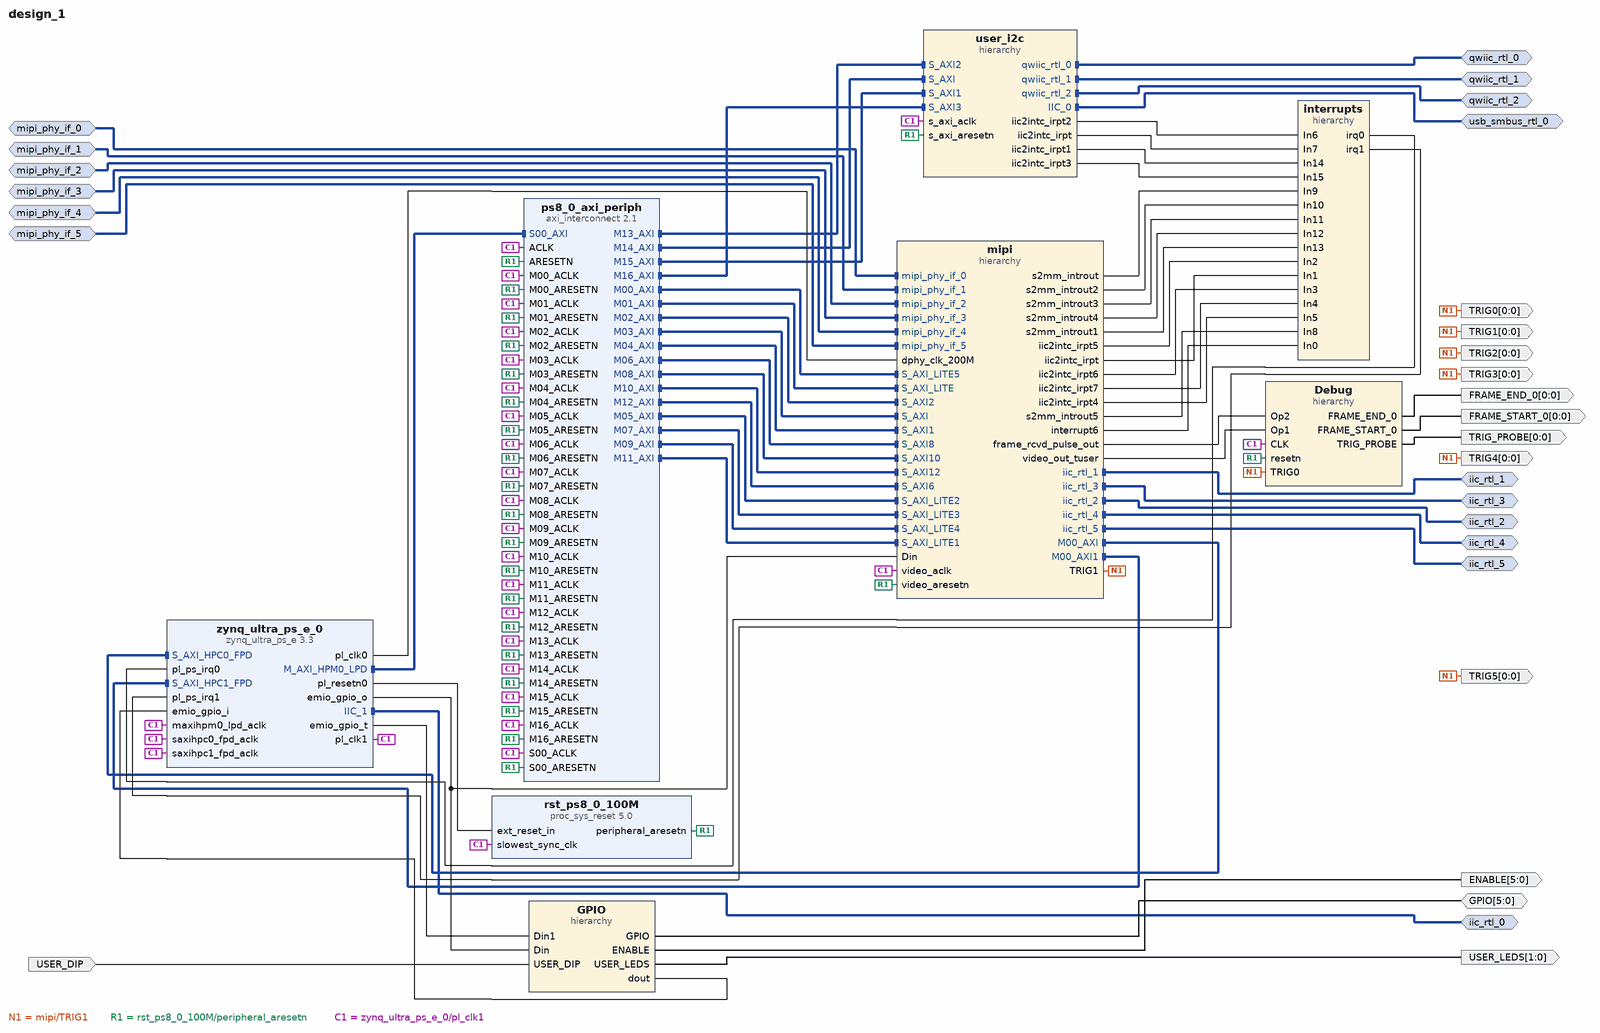
[diagram p0: block diagram of the top level]
# Vivado block design design_1, xczu4ev-sfvc784-1-i, Vivado 2021.2
create_bd_design design_1

create_bd_intf_port -mode Slave -vlnv xilinx.com:interface:mipi_phy_rtl:1.0 mipi_phy_if_0
create_bd_intf_port -mode Master -vlnv xilinx.com:interface:iic_rtl:1.0 iic_rtl_0
create_bd_intf_port -mode Slave -vlnv xilinx.com:interface:mipi_phy_rtl:1.0 mipi_phy_if_1
create_bd_intf_port -mode Master -vlnv xilinx.com:interface:iic_rtl:1.0 iic_rtl_1
create_bd_intf_port -mode Slave -vlnv xilinx.com:interface:mipi_phy_rtl:1.0 mipi_phy_if_3
create_bd_intf_port -mode Slave -vlnv xilinx.com:interface:mipi_phy_rtl:1.0 mipi_phy_if_2
create_bd_intf_port -mode Slave -vlnv xilinx.com:interface:mipi_phy_rtl:1.0 mipi_phy_if_4
create_bd_intf_port -mode Slave -vlnv xilinx.com:interface:mipi_phy_rtl:1.0 mipi_phy_if_5
create_bd_intf_port -mode Master -vlnv xilinx.com:interface:iic_rtl:1.0 iic_rtl_2
create_bd_intf_port -mode Master -vlnv xilinx.com:interface:iic_rtl:1.0 iic_rtl_3
create_bd_intf_port -mode Master -vlnv xilinx.com:interface:iic_rtl:1.0 iic_rtl_4
create_bd_intf_port -mode Master -vlnv xilinx.com:interface:iic_rtl:1.0 iic_rtl_5
create_bd_intf_port -mode Master -vlnv xilinx.com:interface:iic_rtl:1.0 qwiic_rtl_0
create_bd_intf_port -mode Master -vlnv xilinx.com:interface:iic_rtl:1.0 qwiic_rtl_1
create_bd_intf_port -mode Master -vlnv xilinx.com:interface:iic_rtl:1.0 qwiic_rtl_2
create_bd_intf_port -mode Master -vlnv xilinx.com:interface:iic_rtl:1.0 usb_smbus_rtl_0
create_bd_port -dir O -from 0 -to 0 TRIG1
create_bd_port -dir O -from 0 -to 0 TRIG_PROBE
create_bd_port -dir O -from 0 -to 0 FRAME_START_0
create_bd_port -dir O -from 0 -to 0 FRAME_END_0
create_bd_port -dir O -from 0 -to 0 TRIG2
create_bd_port -dir O -from 0 -to 0 TRIG3
create_bd_port -dir O -from 0 -to 0 TRIG4
create_bd_port -dir O -from 0 -to 0 TRIG5
create_bd_port -dir O -from 5 -to 0 ENABLE
create_bd_port -dir O -from 1 -to 0 USER_LEDS
create_bd_port -dir I USER_DIP
create_bd_port -dir IO -from 5 -to 0 GPIO
create_bd_port -dir O -from 0 -to 0 TRIG0

create_bd_cell -type hier GPIO
create_bd_cell -type hier mipi
create_bd_cell -type hier interrupts
create_bd_cell -type hier user_i2c
create_bd_cell -type hier Debug
create_bd_cell -type ip -vlnv xilinx.com:ip:proc_sys_reset:5.0 rst_ps8_0_100M
create_bd_cell -type ip -vlnv xilinx.com:ip:axi_interconnect:2.1 ps8_0_axi_periph
set_property -dict {CONFIG.ENABLE_ADVANCED_OPTIONS 0 CONFIG.NUM_MI 17 CONFIG.NUM_SI 1} [get_bd_cells ps8_0_axi_periph]
create_bd_cell -type ip -vlnv xilinx.com:ip:zynq_ultra_ps_e:3.3 zynq_ultra_ps_e_0
set_property -dict [list \
  CONFIG.CAN0_BOARD_INTERFACE custom \
  CONFIG.CAN1_BOARD_INTERFACE custom \
  CONFIG.CSU_BOARD_INTERFACE custom \
  CONFIG.DP_BOARD_INTERFACE custom \
  CONFIG.GEM0_BOARD_INTERFACE custom \
  CONFIG.GEM1_BOARD_INTERFACE custom \
  CONFIG.GEM2_BOARD_INTERFACE custom \
  CONFIG.GEM3_BOARD_INTERFACE custom \
  CONFIG.GPIO_BOARD_INTERFACE custom \
  CONFIG.IIC0_BOARD_INTERFACE custom \
  CONFIG.IIC1_BOARD_INTERFACE custom \
  CONFIG.NAND_BOARD_INTERFACE custom \
  CONFIG.PCIE_BOARD_INTERFACE custom \
  CONFIG.PJTAG_BOARD_INTERFACE custom \
  CONFIG.PMU_BOARD_INTERFACE custom \
  CONFIG.PSU_BANK_0_IO_STANDARD LVCMOS18 \
  CONFIG.PSU_BANK_1_IO_STANDARD LVCMOS18 \
  CONFIG.PSU_BANK_2_IO_STANDARD LVCMOS18 \
  CONFIG.PSU_BANK_3_IO_STANDARD LVCMOS18 \
  CONFIG.PSU_USB3__DUAL_CLOCK_ENABLE 1 \
  CONFIG.PSU__ACPU2__POWER__ON 0 \
  CONFIG.PSU__ACPU3__POWER__ON 0 \
  CONFIG.PSU__CAN1__PERIPHERAL__ENABLE 0 \
  CONFIG.PSU__CRF_APB__ACPU_CTRL__FREQMHZ 1200 \
  CONFIG.PSU__CRF_APB__ACPU_CTRL__SRCSEL APLL \
  CONFIG.PSU__CRF_APB__APLL_CTRL__SRCSEL PSS_REF_CLK \
  CONFIG.PSU__CRF_APB__DBG_FPD_CTRL__FREQMHZ 250 \
  CONFIG.PSU__CRF_APB__DBG_FPD_CTRL__SRCSEL IOPLL \
  CONFIG.PSU__CRF_APB__DBG_TRACE_CTRL__FREQMHZ 250 \
  CONFIG.PSU__CRF_APB__DBG_TRACE_CTRL__SRCSEL IOPLL \
  CONFIG.PSU__CRF_APB__DBG_TSTMP_CTRL__FREQMHZ 250 \
  CONFIG.PSU__CRF_APB__DBG_TSTMP_CTRL__SRCSEL IOPLL \
  CONFIG.PSU__CRF_APB__DDR_CTRL__FREQMHZ 1200 \
  CONFIG.PSU__CRF_APB__DDR_CTRL__SRCSEL DPLL \
  CONFIG.PSU__CRF_APB__DPDMA_REF_CTRL__FREQMHZ 600 \
  CONFIG.PSU__CRF_APB__DPDMA_REF_CTRL__SRCSEL DPLL \
  CONFIG.PSU__CRF_APB__DPLL_CTRL__SRCSEL PSS_REF_CLK \
  CONFIG.PSU__CRF_APB__DP_AUDIO_REF_CTRL__SRCSEL VPLL \
  CONFIG.PSU__CRF_APB__DP_STC_REF_CTRL__SRCSEL VPLL \
  CONFIG.PSU__CRF_APB__DP_VIDEO_REF_CTRL__SRCSEL DPLL \
  CONFIG.PSU__CRF_APB__GDMA_REF_CTRL__FREQMHZ 600 \
  CONFIG.PSU__CRF_APB__GDMA_REF_CTRL__SRCSEL DPLL \
  CONFIG.PSU__CRF_APB__GPU_REF_CTRL__FREQMHZ 600 \
  CONFIG.PSU__CRF_APB__GPU_REF_CTRL__SRCSEL DPLL \
  CONFIG.PSU__CRF_APB__TOPSW_LSBUS_CTRL__FREQMHZ 100 \
  CONFIG.PSU__CRF_APB__TOPSW_LSBUS_CTRL__SRCSEL IOPLL \
  CONFIG.PSU__CRF_APB__TOPSW_MAIN_CTRL__FREQMHZ 500 \
  CONFIG.PSU__CRF_APB__TOPSW_MAIN_CTRL__SRCSEL VPLL \
  CONFIG.PSU__CRF_APB__VPLL_CTRL__SRCSEL PSS_REF_CLK \
  CONFIG.PSU__CRL_APB__ADMA_REF_CTRL__FREQMHZ 500 \
  CONFIG.PSU__CRL_APB__ADMA_REF_CTRL__SRCSEL RPLL \
  CONFIG.PSU__CRL_APB__CAN1_REF_CTRL__FREQMHZ 100 \
  CONFIG.PSU__CRL_APB__CAN1_REF_CTRL__SRCSEL IOPLL \
  CONFIG.PSU__CRL_APB__CPU_R5_CTRL__FREQMHZ 500 \
  CONFIG.PSU__CRL_APB__CPU_R5_CTRL__SRCSEL RPLL \
  CONFIG.PSU__CRL_APB__DBG_LPD_CTRL__FREQMHZ 250 \
  CONFIG.PSU__CRL_APB__DBG_LPD_CTRL__SRCSEL IOPLL \
  CONFIG.PSU__CRL_APB__GEM3_REF_CTRL__FREQMHZ 125 \
  CONFIG.PSU__CRL_APB__GEM3_REF_CTRL__SRCSEL IOPLL \
  CONFIG.PSU__CRL_APB__I2C0_REF_CTRL__FREQMHZ 100 \
  CONFIG.PSU__CRL_APB__I2C0_REF_CTRL__SRCSEL IOPLL \
  CONFIG.PSU__CRL_APB__I2C1_REF_CTRL__FREQMHZ 100 \
  CONFIG.PSU__CRL_APB__I2C1_REF_CTRL__SRCSEL IOPLL \
  CONFIG.PSU__CRL_APB__IOPLL_CTRL__SRCSEL PSS_REF_CLK \
  CONFIG.PSU__CRL_APB__IOU_SWITCH_CTRL__FREQMHZ 250 \
  CONFIG.PSU__CRL_APB__IOU_SWITCH_CTRL__SRCSEL RPLL \
  CONFIG.PSU__CRL_APB__LPD_LSBUS_CTRL__FREQMHZ 100 \
  CONFIG.PSU__CRL_APB__LPD_LSBUS_CTRL__SRCSEL IOPLL \
  CONFIG.PSU__CRL_APB__LPD_SWITCH_CTRL__FREQMHZ 500 \
  CONFIG.PSU__CRL_APB__LPD_SWITCH_CTRL__SRCSEL RPLL \
  CONFIG.PSU__CRL_APB__PCAP_CTRL__FREQMHZ 200 \
  CONFIG.PSU__CRL_APB__PCAP_CTRL__SRCSEL IOPLL \
  CONFIG.PSU__CRL_APB__PL0_REF_CTRL__FREQMHZ 200 \
  CONFIG.PSU__CRL_APB__PL0_REF_CTRL__SRCSEL RPLL \
  CONFIG.PSU__CRL_APB__QSPI_REF_CTRL__FREQMHZ 50 \
  CONFIG.PSU__CRL_APB__QSPI_REF_CTRL__SRCSEL IOPLL \
  CONFIG.PSU__CRL_APB__RPLL_CTRL__SRCSEL PSS_REF_CLK \
  CONFIG.PSU__CRL_APB__SDIO1_REF_CTRL__FREQMHZ 50 \
  CONFIG.PSU__CRL_APB__SDIO1_REF_CTRL__SRCSEL RPLL \
  CONFIG.PSU__CRL_APB__TIMESTAMP_REF_CTRL__FREQMHZ 100 \
  CONFIG.PSU__CRL_APB__TIMESTAMP_REF_CTRL__SRCSEL PSS_REF_CLK \
  CONFIG.PSU__CRL_APB__UART0_REF_CTRL__FREQMHZ 100 \
  CONFIG.PSU__CRL_APB__UART0_REF_CTRL__SRCSEL IOPLL \
  CONFIG.PSU__CRL_APB__UART1_REF_CTRL__FREQMHZ 100 \
  CONFIG.PSU__CRL_APB__UART1_REF_CTRL__SRCSEL IOPLL \
  CONFIG.PSU__CRL_APB__USB0_BUS_REF_CTRL__FREQMHZ 250 \
  CONFIG.PSU__CRL_APB__USB0_BUS_REF_CTRL__SRCSEL IOPLL \
  CONFIG.PSU__CRL_APB__USB3_DUAL_REF_CTRL__FREQMHZ 20 \
  CONFIG.PSU__CRL_APB__USB3_DUAL_REF_CTRL__SRCSEL IOPLL \
  CONFIG.PSU__CRL_APB__USB3__ENABLE 1 \
  CONFIG.PSU__CSUPMU__PERIPHERAL__VALID 0 \
  CONFIG.PSU__DDRC__BUS_WIDTH {64 Bit} \
  CONFIG.PSU__DDRC__COMPONENTS Components \
  CONFIG.PSU__DDRC__DEVICE_CAPACITY {4096 MBits} \
  CONFIG.PSU__DDRC__DRAM_WIDTH {16 Bits} \
  CONFIG.PSU__DDRC__ECC Enabled \
  CONFIG.PSU__DDRC__MEMORY_TYPE {DDR 4} \
  CONFIG.PSU__DDRC__SPEED_BIN DDR4_2400T \
  CONFIG.PSU__DDR_HIGH_ADDRESS_GUI_ENABLE 0 \
  CONFIG.PSU__DDR__INTERFACE__FREQMHZ 600.000 \
  CONFIG.PSU__DEVICE_TYPE EV \
  CONFIG.PSU__DISPLAYPORT__PERIPHERAL__ENABLE 0 \
  CONFIG.PSU__DLL__ISUSED 1 \
  CONFIG.PSU__ENET0__GRP_MDIO__ENABLE 1 \
  CONFIG.PSU__ENET0__GRP_MDIO__IO {MIO 76 .. 77} \
  CONFIG.PSU__ENET0__PERIPHERAL__ENABLE 1 \
  CONFIG.PSU__ENET0__PERIPHERAL__IO {MIO 26 .. 37} \
  CONFIG.PSU__ENET3__PERIPHERAL__ENABLE 0 \
  CONFIG.PSU__FPD_SLCR__WDT1__FREQMHZ 100 \
  CONFIG.PSU__FPGA_PL0_ENABLE 1 \
  CONFIG.PSU__FPGA_PL1_ENABLE 1 \
  CONFIG.PSU__GEM__TSU__ENABLE 0 \
  CONFIG.PSU__GPIO0_MIO__IO {MIO 0 .. 25} \
  CONFIG.PSU__GPIO0_MIO__PERIPHERAL__ENABLE 1 \
  CONFIG.PSU__GPIO1_MIO__IO {MIO 26 .. 51} \
  CONFIG.PSU__GPIO1_MIO__PERIPHERAL__ENABLE 1 \
  CONFIG.PSU__GPIO_EMIO_WIDTH 22 \
  CONFIG.PSU__GPIO_EMIO__PERIPHERAL__ENABLE 1 \
  CONFIG.PSU__GPIO_EMIO__PERIPHERAL__IO 22 \
  CONFIG.PSU__GPU_PP0__POWER__ON 0 \
  CONFIG.PSU__GPU_PP1__POWER__ON 0 \
  CONFIG.PSU__I2C0__PERIPHERAL__ENABLE 1 \
  CONFIG.PSU__I2C0__PERIPHERAL__IO {MIO 10 .. 11} \
  CONFIG.PSU__I2C1__PERIPHERAL__ENABLE 1 \
  CONFIG.PSU__I2C1__PERIPHERAL__IO EMIO \
  CONFIG.PSU__IOU_SLCR__IOU_TTC_APB_CLK__TTC0_SEL APB \
  CONFIG.PSU__IOU_SLCR__IOU_TTC_APB_CLK__TTC1_SEL APB \
  CONFIG.PSU__IOU_SLCR__IOU_TTC_APB_CLK__TTC2_SEL APB \
  CONFIG.PSU__IOU_SLCR__IOU_TTC_APB_CLK__TTC3_SEL APB \
  CONFIG.PSU__IOU_SLCR__TTC1__FREQMHZ 100 \
  CONFIG.PSU__IOU_SLCR__TTC2__FREQMHZ 100 \
  CONFIG.PSU__IOU_SLCR__TTC3__FREQMHZ 100 \
  CONFIG.PSU__IOU_SLCR__WDT0__FREQMHZ 100 \
  CONFIG.PSU__LPD_SLCR__CSUPMU__FREQMHZ 100 \
  CONFIG.PSU__OVERRIDE_HPX_QOS 0 \
  CONFIG.PSU__OVERRIDE__BASIC_CLOCK 0 \
  CONFIG.PSU__PMU__PERIPHERAL__ENABLE 0 \
  CONFIG.PSU__PRESET_APPLIED 0 \
  CONFIG.PSU__PSS_REF_CLK__FREQMHZ 33.333 \
  CONFIG.PSU__QSPI_COHERENCY 0 \
  CONFIG.PSU__QSPI_ROUTE_THROUGH_FPD 0 \
  CONFIG.PSU__QSPI__GRP_FBCLK__ENABLE 1 \
  CONFIG.PSU__QSPI__GRP_FBCLK__IO {MIO 6} \
  CONFIG.PSU__QSPI__PERIPHERAL__DATA_MODE x4 \
  CONFIG.PSU__QSPI__PERIPHERAL__ENABLE 1 \
  CONFIG.PSU__QSPI__PERIPHERAL__IO {MIO 0 .. 5} \
  CONFIG.PSU__QSPI__PERIPHERAL__MODE Single \
  CONFIG.PSU__SATA__PERIPHERAL__ENABLE 0 \
  CONFIG.PSU__SD0__DATA_TRANSFER_MODE 8Bit \
  CONFIG.PSU__SD0__PERIPHERAL__ENABLE 1 \
  CONFIG.PSU__SD0__PERIPHERAL__IO {MIO 13 .. 22} \
  CONFIG.PSU__SD0__SLOT_TYPE eMMC \
  CONFIG.PSU__SD1_COHERENCY 0 \
  CONFIG.PSU__SD1_ROUTE_THROUGH_FPD 0 \
  CONFIG.PSU__SD1__DATA_TRANSFER_MODE 4Bit \
  CONFIG.PSU__SD1__GRP_CD__ENABLE 0 \
  CONFIG.PSU__SD1__GRP_POW__ENABLE 0 \
  CONFIG.PSU__SD1__GRP_WP__ENABLE 0 \
  CONFIG.PSU__SD1__PERIPHERAL__ENABLE 1 \
  CONFIG.PSU__SD1__PERIPHERAL__IO {MIO 46 .. 51} \
  CONFIG.PSU__SD1__SLOT_TYPE {SD 2.0} \
  CONFIG.PSU__SWDT0__PERIPHERAL__ENABLE 0 \
  CONFIG.PSU__SWDT1__PERIPHERAL__ENABLE 0 \
  CONFIG.PSU__TSU__BUFG_PORT_PAIR 0 \
  CONFIG.PSU__TTC0__CLOCK__ENABLE 0 \
  CONFIG.PSU__TTC0__PERIPHERAL__ENABLE 1 \
  CONFIG.PSU__TTC0__WAVEOUT__ENABLE 0 \
  CONFIG.PSU__TTC1__PERIPHERAL__ENABLE 0 \
  CONFIG.PSU__TTC2__PERIPHERAL__ENABLE 0 \
  CONFIG.PSU__TTC3__PERIPHERAL__ENABLE 0 \
  CONFIG.PSU__UART0__BAUD_RATE 115200 \
  CONFIG.PSU__UART0__MODEM__ENABLE 0 \
  CONFIG.PSU__UART0__PERIPHERAL__ENABLE 1 \
  CONFIG.PSU__UART0__PERIPHERAL__IO {MIO 38 .. 39} \
  CONFIG.PSU__UART1__PERIPHERAL__ENABLE 0 \
  CONFIG.PSU__USB0_COHERENCY 0 \
  CONFIG.PSU__USB0__PERIPHERAL__ENABLE 1 \
  CONFIG.PSU__USB0__PERIPHERAL__IO {MIO 52 .. 63} \
  CONFIG.PSU__USB0__REF_CLK_FREQ 100 \
  CONFIG.PSU__USB0__REF_CLK_SEL {Ref Clk2} \
  CONFIG.PSU__USB1__PERIPHERAL__ENABLE 1 \
  CONFIG.PSU__USB1__PERIPHERAL__IO {MIO 64 .. 75} \
  CONFIG.PSU__USB1__REF_CLK_FREQ 100 \
  CONFIG.PSU__USB1__REF_CLK_SEL {Ref Clk2} \
  CONFIG.PSU__USB2_0__EMIO__ENABLE 0 \
  CONFIG.PSU__USB3_0__EMIO__ENABLE 0 \
  CONFIG.PSU__USB3_0__PERIPHERAL__ENABLE 1 \
  CONFIG.PSU__USB3_0__PERIPHERAL__IO {GT Lane0} \
  CONFIG.PSU__USB3_1__PERIPHERAL__ENABLE 1 \
  CONFIG.PSU__USB3_1__PERIPHERAL__IO {GT Lane3} \
  CONFIG.PSU__USB__RESET__MODE {Boot Pin} \
  CONFIG.PSU__USB__RESET__POLARITY {Active Low} \
  CONFIG.PSU__USE__IRQ0 1 \
  CONFIG.PSU__USE__IRQ1 1 \
  CONFIG.PSU__USE__M_AXI_GP0 0 \
  CONFIG.PSU__USE__M_AXI_GP1 0 \
  CONFIG.PSU__USE__M_AXI_GP2 1 \
  CONFIG.PSU__USE__S_AXI_GP0 1 \
  CONFIG.PSU__USE__S_AXI_GP1 1 \
  CONFIG.QSPI_BOARD_INTERFACE custom \
  CONFIG.SATA_BOARD_INTERFACE custom \
  CONFIG.SD0_BOARD_INTERFACE custom \
  CONFIG.SD1_BOARD_INTERFACE custom \
  CONFIG.SPI0_BOARD_INTERFACE custom \
  CONFIG.SPI1_BOARD_INTERFACE custom \
  CONFIG.SUBPRESET1 Custom \
  CONFIG.SUBPRESET2 Custom \
  CONFIG.SWDT0_BOARD_INTERFACE custom \
  CONFIG.SWDT1_BOARD_INTERFACE custom \
  CONFIG.TRACE_BOARD_INTERFACE custom \
  CONFIG.TTC0_BOARD_INTERFACE custom \
  CONFIG.TTC1_BOARD_INTERFACE custom \
  CONFIG.TTC2_BOARD_INTERFACE custom \
  CONFIG.TTC3_BOARD_INTERFACE custom \
  CONFIG.UART0_BOARD_INTERFACE custom \
  CONFIG.UART1_BOARD_INTERFACE custom \
  CONFIG.USB0_BOARD_INTERFACE custom \
  CONFIG.USB1_BOARD_INTERFACE custom \
] [get_bd_cells zynq_ultra_ps_e_0]
# 738 more settings of zynq_ultra_ps_e_0 are not shown: defaults, MIO pin electricals, DDR timing, and values the tool derives

# ---- hierarchy /GPIO ----
current_bd_instance /GPIO
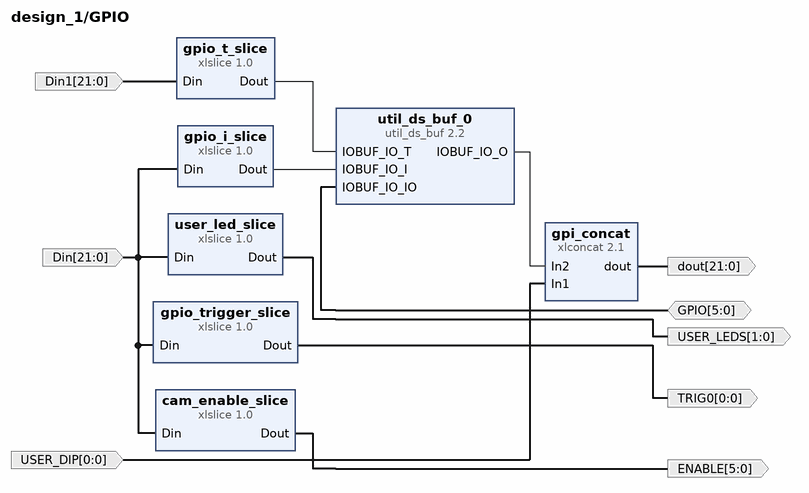
[diagram p1: block diagram inside /GPIO]
create_bd_pin -dir I -from 21 -to 0 Din
create_bd_pin -dir O -from 0 -to 0 TRIG0
create_bd_pin -dir O -from 1 -to 0 USER_LEDS
create_bd_pin -dir O -from 5 -to 0 ENABLE
create_bd_pin -dir I -from 21 -to 0 Din1
create_bd_pin -dir IO -from 5 -to 0 GPIO
create_bd_pin -dir I -from 0 -to 0 USER_DIP
create_bd_pin -dir O -from 21 -to 0 dout

create_bd_cell -type ip -vlnv xilinx.com:ip:xlslice:1.0 gpio_trigger_slice
set_property -dict {CONFIG.DIN_FROM 15 CONFIG.DIN_TO 15 CONFIG.DIN_WIDTH 22 CONFIG.DOUT_WIDTH 1} [get_bd_cells gpio_trigger_slice]
create_bd_cell -type ip -vlnv xilinx.com:ip:xlslice:1.0 user_led_slice
set_property -dict {CONFIG.DIN_FROM 8 CONFIG.DIN_TO 7 CONFIG.DIN_WIDTH 22 CONFIG.DOUT_WIDTH 2} [get_bd_cells user_led_slice]
create_bd_cell -type ip -vlnv xilinx.com:ip:xlslice:1.0 gpio_i_slice
set_property -dict {CONFIG.DIN_FROM 14 CONFIG.DIN_TO 9 CONFIG.DIN_WIDTH 22 CONFIG.DOUT_WIDTH 6} [get_bd_cells gpio_i_slice]
create_bd_cell -type ip -vlnv xilinx.com:ip:xlslice:1.0 cam_enable_slice
set_property -dict {CONFIG.DIN_FROM 5 CONFIG.DIN_WIDTH 22 CONFIG.DOUT_WIDTH 6} [get_bd_cells cam_enable_slice]
create_bd_cell -type ip -vlnv xilinx.com:ip:xlslice:1.0 gpio_t_slice
set_property -dict {CONFIG.DIN_FROM 14 CONFIG.DIN_TO 9 CONFIG.DIN_WIDTH 22 CONFIG.DOUT_WIDTH 6} [get_bd_cells gpio_t_slice]
create_bd_cell -type ip -vlnv xilinx.com:ip:xlconcat:2.1 gpi_concat
set_property -dict [list \
  CONFIG.IN0_WIDTH 8 \
  CONFIG.IN1_WIDTH 1 \
  CONFIG.IN2_WIDTH 6 \
  CONFIG.IN3_WIDTH 7 \
  CONFIG.NUM_PORTS 4 \
] [get_bd_cells gpi_concat]
create_bd_cell -type ip -vlnv xilinx.com:ip:util_ds_buf:2.2 util_ds_buf_0
set_property -dict {CONFIG.C_BUF_TYPE IOBUF CONFIG.C_SIZE 6} [get_bd_cells util_ds_buf_0]

# ---- hierarchy /mipi ----
current_bd_instance /mipi
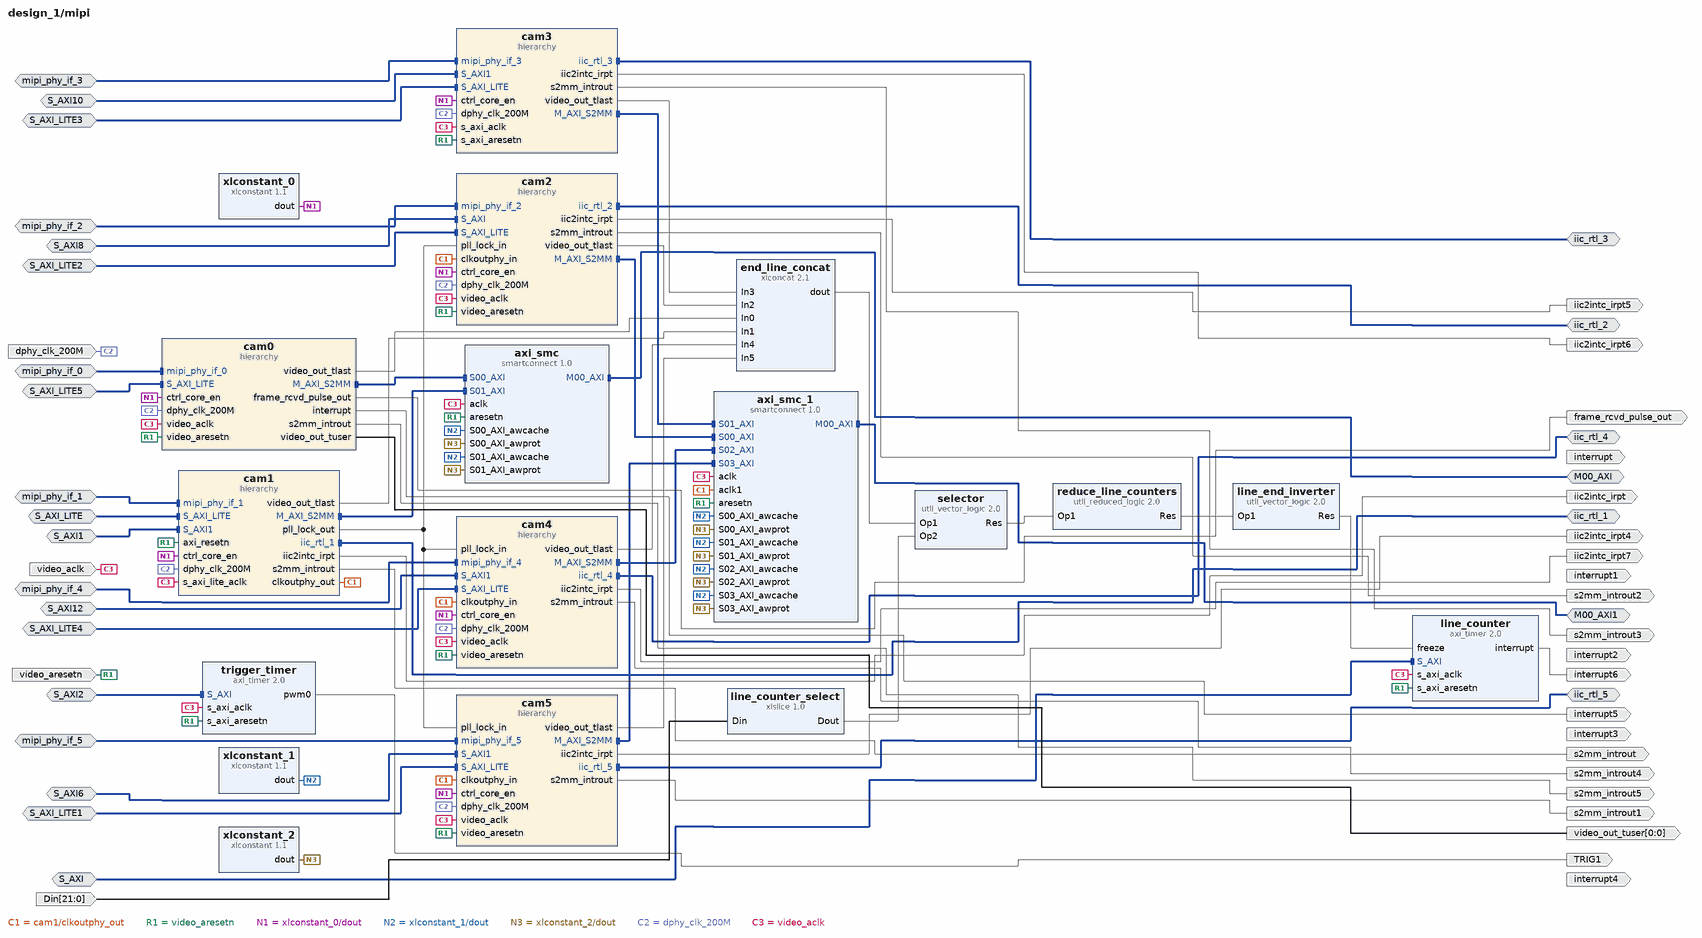
[diagram p2: block diagram inside /mipi]
create_bd_intf_pin -mode Slave -vlnv xilinx.com:interface:mipi_phy_rtl:1.0 mipi_phy_if_1
create_bd_intf_pin -mode Slave -vlnv xilinx.com:interface:aximm_rtl:1.0 S_AXI_LITE
create_bd_intf_pin -mode Slave -vlnv xilinx.com:interface:aximm_rtl:1.0 S_AXI1
create_bd_intf_pin -mode Master -vlnv xilinx.com:interface:iic_rtl:1.0 iic_rtl_1
create_bd_intf_pin -mode Slave -vlnv xilinx.com:interface:mipi_phy_rtl:1.0 mipi_phy_if_5
create_bd_intf_pin -mode Slave -vlnv xilinx.com:interface:aximm_rtl:1.0 S_AXI_LITE1
create_bd_intf_pin -mode Slave -vlnv xilinx.com:interface:aximm_rtl:1.0 S_AXI6
create_bd_intf_pin -mode Master -vlnv xilinx.com:interface:iic_rtl:1.0 iic_rtl_5
create_bd_intf_pin -mode Slave -vlnv xilinx.com:interface:mipi_phy_rtl:1.0 mipi_phy_if_2
create_bd_intf_pin -mode Slave -vlnv xilinx.com:interface:aximm_rtl:1.0 S_AXI_LITE2
create_bd_intf_pin -mode Slave -vlnv xilinx.com:interface:aximm_rtl:1.0 S_AXI8
create_bd_intf_pin -mode Master -vlnv xilinx.com:interface:iic_rtl:1.0 iic_rtl_2
create_bd_intf_pin -mode Slave -vlnv xilinx.com:interface:mipi_phy_rtl:1.0 mipi_phy_if_3
create_bd_intf_pin -mode Slave -vlnv xilinx.com:interface:aximm_rtl:1.0 S_AXI_LITE3
create_bd_intf_pin -mode Slave -vlnv xilinx.com:interface:aximm_rtl:1.0 S_AXI10
create_bd_intf_pin -mode Slave -vlnv xilinx.com:interface:aximm_rtl:1.0 S_AXI12
create_bd_intf_pin -mode Master -vlnv xilinx.com:interface:iic_rtl:1.0 iic_rtl_4
create_bd_intf_pin -mode Slave -vlnv xilinx.com:interface:mipi_phy_rtl:1.0 mipi_phy_if_4
create_bd_intf_pin -mode Slave -vlnv xilinx.com:interface:aximm_rtl:1.0 S_AXI_LITE4
create_bd_intf_pin -mode Slave -vlnv xilinx.com:interface:mipi_phy_rtl:1.0 mipi_phy_if_0
create_bd_intf_pin -mode Slave -vlnv xilinx.com:interface:aximm_rtl:1.0 S_AXI_LITE5
create_bd_intf_pin -mode Master -vlnv xilinx.com:interface:aximm_rtl:1.0 M00_AXI
create_bd_intf_pin -mode Master -vlnv xilinx.com:interface:aximm_rtl:1.0 M00_AXI1
create_bd_intf_pin -mode Master -vlnv xilinx.com:interface:iic_rtl:1.0 iic_rtl_3
create_bd_intf_pin -mode Slave -vlnv xilinx.com:interface:aximm_rtl:1.0 S_AXI
create_bd_intf_pin -mode Slave -vlnv xilinx.com:interface:aximm_rtl:1.0 S_AXI2
create_bd_pin -dir I -type clk dphy_clk_200M
create_bd_pin -dir I -type clk video_aclk
create_bd_pin -dir I -type rst video_aresetn
create_bd_pin -dir O -type intr s2mm_introut
create_bd_pin -dir O -type intr interrupt
create_bd_pin -dir O -type intr iic2intc_irpt
create_bd_pin -dir O -type intr interrupt1
create_bd_pin -dir O -type intr s2mm_introut1
create_bd_pin -dir O -type intr iic2intc_irpt4
create_bd_pin -dir O -type intr s2mm_introut2
create_bd_pin -dir O -type intr interrupt2
create_bd_pin -dir O -type intr iic2intc_irpt5
create_bd_pin -dir O -type intr s2mm_introut3
create_bd_pin -dir O -type intr interrupt3
create_bd_pin -dir O -type intr iic2intc_irpt6
create_bd_pin -dir O -type intr interrupt4
create_bd_pin -dir O -type intr iic2intc_irpt7
create_bd_pin -dir O -type intr s2mm_introut4
create_bd_pin -dir O -from 0 -to 0 video_out_tuser
create_bd_pin -dir O frame_rcvd_pulse_out
create_bd_pin -dir O -type intr s2mm_introut5
create_bd_pin -dir O -type intr interrupt5
create_bd_pin -dir O -type intr interrupt6
create_bd_pin -dir I -from 21 -to 0 Din
create_bd_pin -dir O TRIG1

create_bd_cell -type hier cam1
create_bd_cell -type hier cam5
create_bd_cell -type hier cam2
create_bd_cell -type hier cam3
create_bd_cell -type hier cam4
create_bd_cell -type hier cam0
create_bd_cell -type ip -vlnv xilinx.com:ip:util_vector_logic:2.0 selector
set_property -dict {CONFIG.C_SIZE 6} [get_bd_cells selector]
create_bd_cell -type ip -vlnv xilinx.com:ip:util_reduced_logic:2.0 reduce_line_counters
set_property -dict {CONFIG.C_OPERATION or CONFIG.C_SIZE 6} [get_bd_cells reduce_line_counters]
create_bd_cell -type ip -vlnv xilinx.com:ip:util_vector_logic:2.0 line_end_inverter
set_property -dict {CONFIG.C_OPERATION not CONFIG.C_SIZE 1} [get_bd_cells line_end_inverter]
create_bd_cell -type ip -vlnv xilinx.com:ip:xlconcat:2.1 end_line_concat
set_property -dict {CONFIG.NUM_PORTS 6 CONFIG.dout_width 6} [get_bd_cells end_line_concat]
create_bd_cell -type ip -vlnv xilinx.com:ip:xlslice:1.0 line_counter_select
set_property -dict [list \
  CONFIG.DIN_FROM 21 \
  CONFIG.DIN_TO 16 \
  CONFIG.DIN_WIDTH 22 \
  CONFIG.DOUT_WIDTH 6 \
] [get_bd_cells line_counter_select]
create_bd_cell -type ip -vlnv xilinx.com:ip:xlconstant:1.1 xlconstant_0
create_bd_cell -type ip -vlnv xilinx.com:ip:xlconstant:1.1 xlconstant_1
set_property -dict {CONFIG.CONST_VAL 15 CONFIG.CONST_WIDTH 4} [get_bd_cells xlconstant_1]
create_bd_cell -type ip -vlnv xilinx.com:ip:xlconstant:1.1 xlconstant_2
set_property -dict {CONFIG.CONST_VAL 2 CONFIG.CONST_WIDTH 3} [get_bd_cells xlconstant_2]
create_bd_cell -type ip -vlnv xilinx.com:ip:smartconnect:1.0 axi_smc
set_property -dict {CONFIG.NUM_SI 2} [get_bd_cells axi_smc]
create_bd_cell -type ip -vlnv xilinx.com:ip:smartconnect:1.0 axi_smc_1
set_property -dict {CONFIG.NUM_CLKS 2 CONFIG.NUM_SI 4} [get_bd_cells axi_smc_1]
create_bd_cell -type ip -vlnv xilinx.com:ip:axi_timer:2.0 line_counter
set_property -dict {CONFIG.enable_timer2 0} [get_bd_cells line_counter]
create_bd_cell -type ip -vlnv xilinx.com:ip:axi_timer:2.0 trigger_timer

# ---- hierarchy /mipi/cam1 ----
current_bd_instance /mipi/cam1
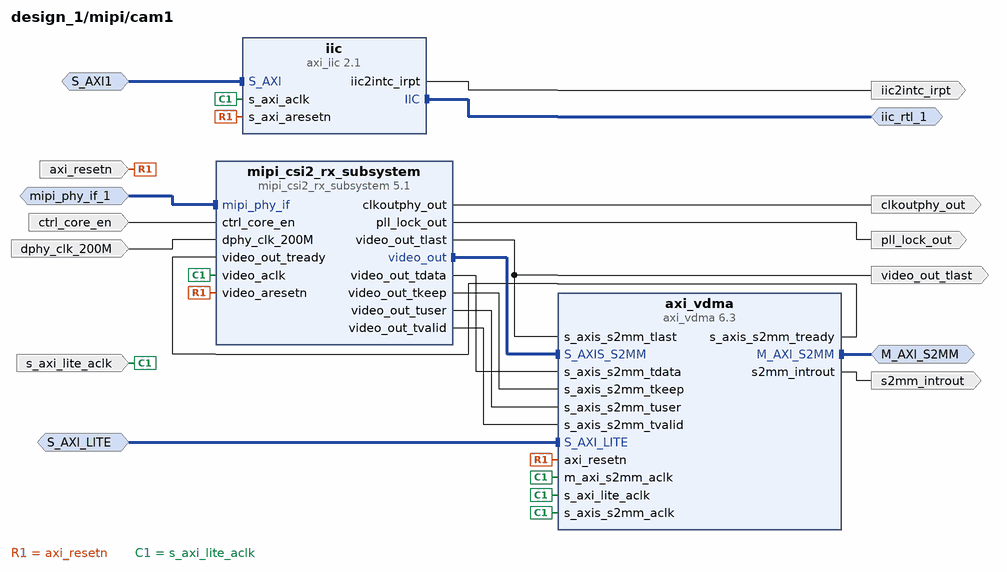
[diagram p3: block diagram inside /mipi/cam1]
create_bd_intf_pin -mode Slave -vlnv xilinx.com:interface:mipi_phy_rtl:1.0 mipi_phy_if_1
create_bd_intf_pin -mode Slave -vlnv xilinx.com:interface:aximm_rtl:1.0 S_AXI_LITE
create_bd_intf_pin -mode Master -vlnv xilinx.com:interface:aximm_rtl:1.0 M_AXI_S2MM
create_bd_intf_pin -mode Slave -vlnv xilinx.com:interface:aximm_rtl:1.0 S_AXI1
create_bd_intf_pin -mode Master -vlnv xilinx.com:interface:iic_rtl:1.0 iic_rtl_1
create_bd_pin -dir I -type clk dphy_clk_200M
create_bd_pin -dir O -type clk clkoutphy_out
create_bd_pin -dir O pll_lock_out
create_bd_pin -dir I -type clk s_axi_lite_aclk
create_bd_pin -dir I -type rst axi_resetn
create_bd_pin -dir I ctrl_core_en
create_bd_pin -dir O -type intr s2mm_introut
create_bd_pin -dir O -type intr iic2intc_irpt
create_bd_pin -dir O video_out_tlast

create_bd_cell -type ip -vlnv xilinx.com:ip:axi_vdma:6.3 axi_vdma
set_property -dict [list \
  CONFIG.c_include_mm2s 0 \
  CONFIG.c_num_fstores 4 \
  CONFIG.c_s2mm_genlock_mode 0 \
  CONFIG.c_s2mm_linebuffer_depth 256 \
  CONFIG.c_use_s2mm_fsync 0 \
] [get_bd_cells axi_vdma]
create_bd_cell -type ip -vlnv xilinx.com:ip:axi_iic:2.1 iic
create_bd_cell -type ip -vlnv xilinx.com:ip:mipi_csi2_rx_subsystem:5.1 mipi_csi2_rx_subsystem
set_property -dict [list \
  CONFIG.AXIS_TDATA_WIDTH 32 \
  CONFIG.AXIS_TUSER_WIDTH 1 \
  CONFIG.CLK_LANE_IO_LOC J5 \
  CONFIG.CMN_INC_VFB false \
  CONFIG.CMN_NUM_LANES 4 \
  CONFIG.CMN_PXL_FORMAT RAW20 \
  CONFIG.CSI_BUF_DEPTH 512 \
  CONFIG.CSI_CONTROLLER_REG_IF false \
  CONFIG.C_CLK_LANE_IO_POSITION 39 \
  CONFIG.C_CSI_EN_CRC false \
  CONFIG.C_DATA_LANE0_IO_POSITION 41 \
  CONFIG.C_DATA_LANE1_IO_POSITION 43 \
  CONFIG.C_DATA_LANE2_IO_POSITION 45 \
  CONFIG.C_DATA_LANE3_IO_POSITION 47 \
  CONFIG.C_DPHY_LANES 4 \
  CONFIG.C_EN_CSI_V2_0 true \
  CONFIG.C_HS_LINE_RATE 1100 \
  CONFIG.C_HS_SETTLE_NS 144 \
  CONFIG.DATA_LANE0_IO_LOC J6 \
  CONFIG.DATA_LANE1_IO_LOC J7 \
  CONFIG.DATA_LANE2_IO_LOC K8 \
  CONFIG.DATA_LANE3_IO_LOC K9 \
  CONFIG.DPY_LINE_RATE 1100 \
  CONFIG.HP_IO_BANK_SELECTION 65 \
  CONFIG.SupportLevel 1 \
] [get_bd_cells mipi_csi2_rx_subsystem]

# ---- hierarchy /mipi/cam5 ----
current_bd_instance /mipi/cam5
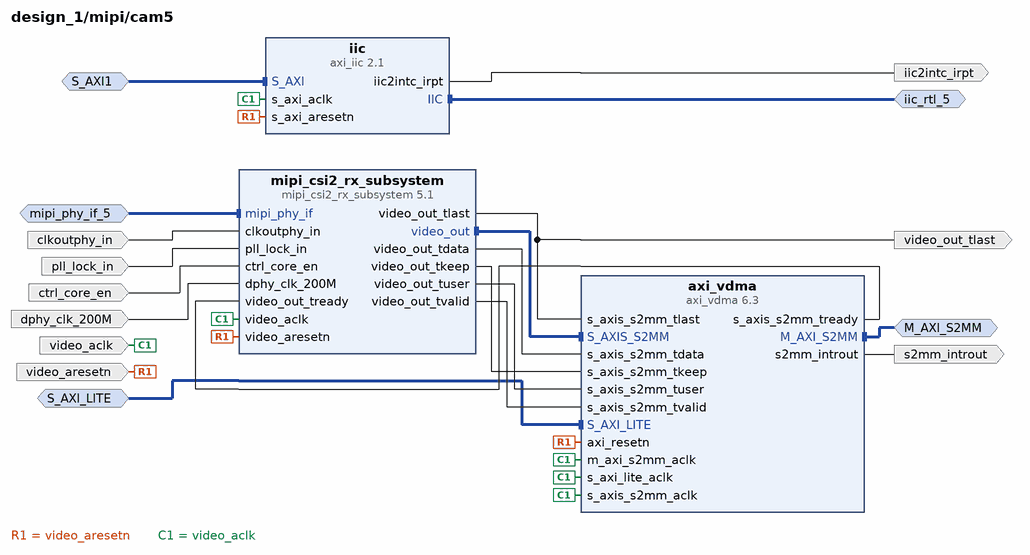
[diagram p4: block diagram inside /mipi/cam5]
create_bd_intf_pin -mode Slave -vlnv xilinx.com:interface:mipi_phy_rtl:1.0 mipi_phy_if_5
create_bd_intf_pin -mode Slave -vlnv xilinx.com:interface:aximm_rtl:1.0 S_AXI_LITE
create_bd_intf_pin -mode Master -vlnv xilinx.com:interface:aximm_rtl:1.0 M_AXI_S2MM
create_bd_intf_pin -mode Slave -vlnv xilinx.com:interface:aximm_rtl:1.0 S_AXI1
create_bd_intf_pin -mode Master -vlnv xilinx.com:interface:iic_rtl:1.0 iic_rtl_5
create_bd_pin -dir I -type clk video_aclk
create_bd_pin -dir I -type rst video_aresetn
create_bd_pin -dir I -type clk dphy_clk_200M
create_bd_pin -dir I -type clk clkoutphy_in
create_bd_pin -dir I pll_lock_in
create_bd_pin -dir I ctrl_core_en
create_bd_pin -dir O -type intr s2mm_introut
create_bd_pin -dir O -type intr iic2intc_irpt
create_bd_pin -dir O video_out_tlast

create_bd_cell -type ip -vlnv xilinx.com:ip:axi_vdma:6.3 axi_vdma
set_property -dict [list \
  CONFIG.c_include_mm2s 0 \
  CONFIG.c_num_fstores 4 \
  CONFIG.c_s2mm_genlock_mode 0 \
  CONFIG.c_s2mm_linebuffer_depth 256 \
  CONFIG.c_use_s2mm_fsync 0 \
] [get_bd_cells axi_vdma]
create_bd_cell -type ip -vlnv xilinx.com:ip:axi_iic:2.1 iic
create_bd_cell -type ip -vlnv xilinx.com:ip:mipi_csi2_rx_subsystem:5.1 mipi_csi2_rx_subsystem
set_property -dict [list \
  CONFIG.AXIS_TDATA_WIDTH 32 \
  CONFIG.AXIS_TUSER_WIDTH 1 \
  CONFIG.CLK_LANE_IO_LOC L1 \
  CONFIG.CMN_INC_VFB false \
  CONFIG.CMN_NUM_LANES 2 \
  CONFIG.CMN_PXL_FORMAT RAW20 \
  CONFIG.CSI_BUF_DEPTH 512 \
  CONFIG.CSI_CONTROLLER_REG_IF false \
  CONFIG.C_CLK_LANE_IO_POSITION 13 \
  CONFIG.C_CSI_EN_CRC false \
  CONFIG.C_DATA_LANE0_IO_POSITION 15 \
  CONFIG.C_DATA_LANE1_IO_POSITION 17 \
  CONFIG.C_DPHY_LANES 2 \
  CONFIG.C_EN_BG0_PIN0 false \
  CONFIG.C_EN_CSI_V2_0 true \
  CONFIG.C_HS_LINE_RATE 1100 \
  CONFIG.C_HS_SETTLE_NS 144 \
  CONFIG.DATA_LANE0_IO_LOC J1 \
  CONFIG.DATA_LANE1_IO_LOC K2 \
  CONFIG.DPY_LINE_RATE 1100 \
  CONFIG.HP_IO_BANK_SELECTION 65 \
  CONFIG.SupportLevel 0 \
] [get_bd_cells mipi_csi2_rx_subsystem]

# ---- hierarchy /mipi/cam2 ----
current_bd_instance /mipi/cam2
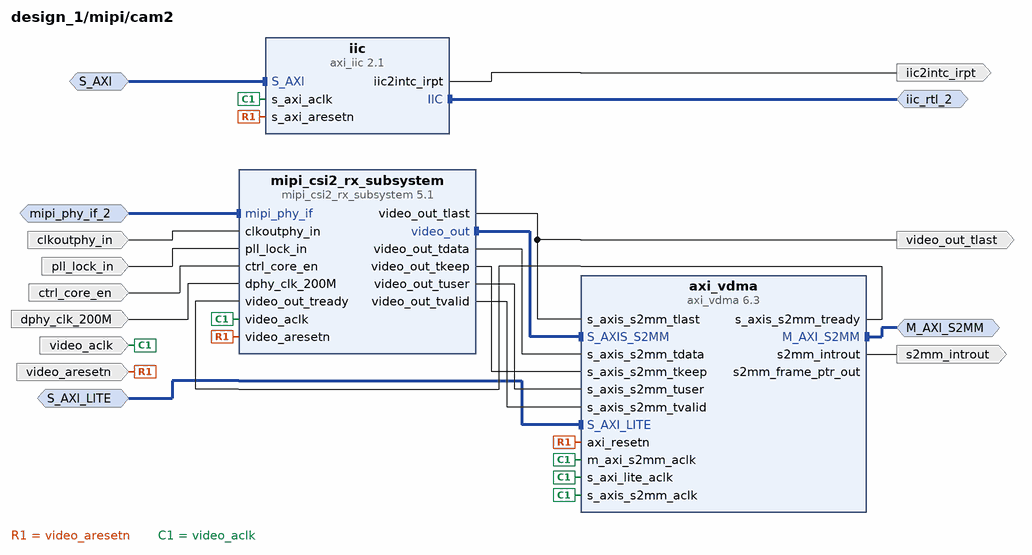
[diagram p5: block diagram inside /mipi/cam2]
create_bd_intf_pin -mode Slave -vlnv xilinx.com:interface:mipi_phy_rtl:1.0 mipi_phy_if_2
create_bd_intf_pin -mode Slave -vlnv xilinx.com:interface:aximm_rtl:1.0 S_AXI_LITE
create_bd_intf_pin -mode Master -vlnv xilinx.com:interface:aximm_rtl:1.0 M_AXI_S2MM
create_bd_intf_pin -mode Slave -vlnv xilinx.com:interface:aximm_rtl:1.0 S_AXI
create_bd_intf_pin -mode Master -vlnv xilinx.com:interface:iic_rtl:1.0 iic_rtl_2
create_bd_pin -dir I -type clk video_aclk
create_bd_pin -dir I -type rst video_aresetn
create_bd_pin -dir I -type clk dphy_clk_200M
create_bd_pin -dir I -type clk clkoutphy_in
create_bd_pin -dir I pll_lock_in
create_bd_pin -dir I ctrl_core_en
create_bd_pin -dir O -type intr s2mm_introut
create_bd_pin -dir O -type intr iic2intc_irpt
create_bd_pin -dir O video_out_tlast

create_bd_cell -type ip -vlnv xilinx.com:ip:axi_vdma:6.3 axi_vdma
set_property -dict [list \
  CONFIG.c_include_mm2s 0 \
  CONFIG.c_num_fstores 4 \
  CONFIG.c_s2mm_genlock_mode 0 \
  CONFIG.c_s2mm_linebuffer_depth 256 \
  CONFIG.c_use_s2mm_fsync 0 \
] [get_bd_cells axi_vdma]
create_bd_cell -type ip -vlnv xilinx.com:ip:axi_iic:2.1 iic
create_bd_cell -type ip -vlnv xilinx.com:ip:mipi_csi2_rx_subsystem:5.1 mipi_csi2_rx_subsystem
set_property -dict [list \
  CONFIG.AXIS_TDATA_WIDTH 32 \
  CONFIG.AXIS_TDEST_WIDTH 4 \
  CONFIG.AXIS_TUSER_WIDTH 1 \
  CONFIG.CLK_LANE_IO_LOC L7 \
  CONFIG.CMN_INC_VFB false \
  CONFIG.CMN_NUM_LANES 2 \
  CONFIG.CMN_PXL_FORMAT RAW20 \
  CONFIG.CSI_BUF_DEPTH 512 \
  CONFIG.CSI_CONTROLLER_REG_IF false \
  CONFIG.C_CLK_LANE_IO_POSITION 26 \
  CONFIG.C_CSI_EN_CRC false \
  CONFIG.C_DATA_LANE0_IO_POSITION 28 \
  CONFIG.C_DATA_LANE1_IO_POSITION 30 \
  CONFIG.C_DPHY_LANES 2 \
  CONFIG.C_EN_BG0_PIN0 false \
  CONFIG.C_EN_BG1_PIN0 false \
  CONFIG.C_EN_CSI_V2_0 true \
  CONFIG.C_EN_VCX false \
  CONFIG.C_HS_LINE_RATE 1100 \
  CONFIG.C_HS_SETTLE_NS 144 \
  CONFIG.DATA_LANE0_IO_LOC M6 \
  CONFIG.DATA_LANE1_IO_LOC N7 \
  CONFIG.DPY_LINE_RATE 1100 \
  CONFIG.HP_IO_BANK_SELECTION 65 \
  CONFIG.SupportLevel 0 \
] [get_bd_cells mipi_csi2_rx_subsystem]

# ---- hierarchy /mipi/cam3 ----
current_bd_instance /mipi/cam3
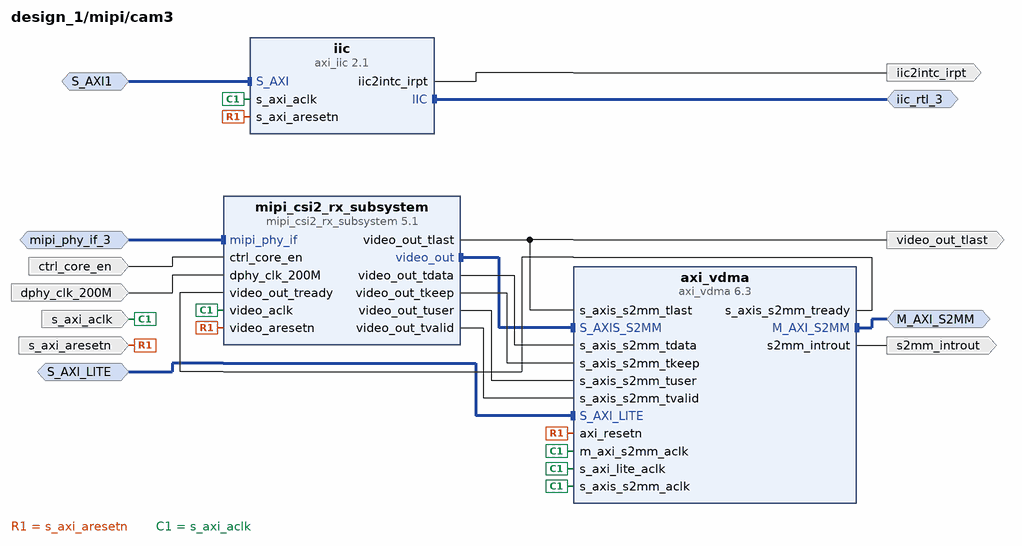
[diagram p6: block diagram inside /mipi/cam3]
create_bd_intf_pin -mode Slave -vlnv xilinx.com:interface:mipi_phy_rtl:1.0 mipi_phy_if_3
create_bd_intf_pin -mode Slave -vlnv xilinx.com:interface:aximm_rtl:1.0 S_AXI_LITE
create_bd_intf_pin -mode Master -vlnv xilinx.com:interface:aximm_rtl:1.0 M_AXI_S2MM
create_bd_intf_pin -mode Slave -vlnv xilinx.com:interface:aximm_rtl:1.0 S_AXI1
create_bd_intf_pin -mode Master -vlnv xilinx.com:interface:iic_rtl:1.0 iic_rtl_3
create_bd_pin -dir I -type clk dphy_clk_200M
create_bd_pin -dir I -type clk s_axi_aclk
create_bd_pin -dir I -type rst s_axi_aresetn
create_bd_pin -dir I ctrl_core_en
create_bd_pin -dir O -type intr s2mm_introut
create_bd_pin -dir O -type intr iic2intc_irpt
create_bd_pin -dir O video_out_tlast

create_bd_cell -type ip -vlnv xilinx.com:ip:axi_vdma:6.3 axi_vdma
set_property -dict [list \
  CONFIG.c_include_mm2s 0 \
  CONFIG.c_num_fstores 4 \
  CONFIG.c_s2mm_genlock_mode 0 \
  CONFIG.c_s2mm_linebuffer_depth 256 \
  CONFIG.c_use_s2mm_fsync 0 \
] [get_bd_cells axi_vdma]
create_bd_cell -type ip -vlnv xilinx.com:ip:axi_iic:2.1 iic
create_bd_cell -type ip -vlnv xilinx.com:ip:mipi_csi2_rx_subsystem:5.1 mipi_csi2_rx_subsystem
set_property -dict [list \
  CONFIG.AXIS_TDATA_WIDTH 32 \
  CONFIG.AXIS_TUSER_WIDTH 1 \
  CONFIG.CLK_LANE_IO_LOC B5 \
  CONFIG.CMN_INC_VFB false \
  CONFIG.CMN_NUM_LANES 4 \
  CONFIG.CMN_PXL_FORMAT RAW20 \
  CONFIG.CSI_BUF_DEPTH 512 \
  CONFIG.CSI_CONTROLLER_REG_IF false \
  CONFIG.C_CLK_LANE_IO_POSITION 39 \
  CONFIG.C_CSI_EN_CRC false \
  CONFIG.C_DATA_LANE0_IO_POSITION 41 \
  CONFIG.C_DATA_LANE1_IO_POSITION 43 \
  CONFIG.C_DATA_LANE2_IO_POSITION 45 \
  CONFIG.C_DATA_LANE3_IO_POSITION 47 \
  CONFIG.C_DPHY_LANES 4 \
  CONFIG.C_EN_CSI_V2_0 true \
  CONFIG.C_HS_LINE_RATE 1100 \
  CONFIG.C_HS_SETTLE_NS 144 \
  CONFIG.DATA_LANE0_IO_LOC C6 \
  CONFIG.DATA_LANE1_IO_LOC A7 \
  CONFIG.DATA_LANE2_IO_LOC C8 \
  CONFIG.DATA_LANE3_IO_LOC A9 \
  CONFIG.DPY_LINE_RATE 1100 \
  CONFIG.HP_IO_BANK_SELECTION 66 \
  CONFIG.SupportLevel 1 \
] [get_bd_cells mipi_csi2_rx_subsystem]

# ---- hierarchy /mipi/cam4 ----
current_bd_instance /mipi/cam4
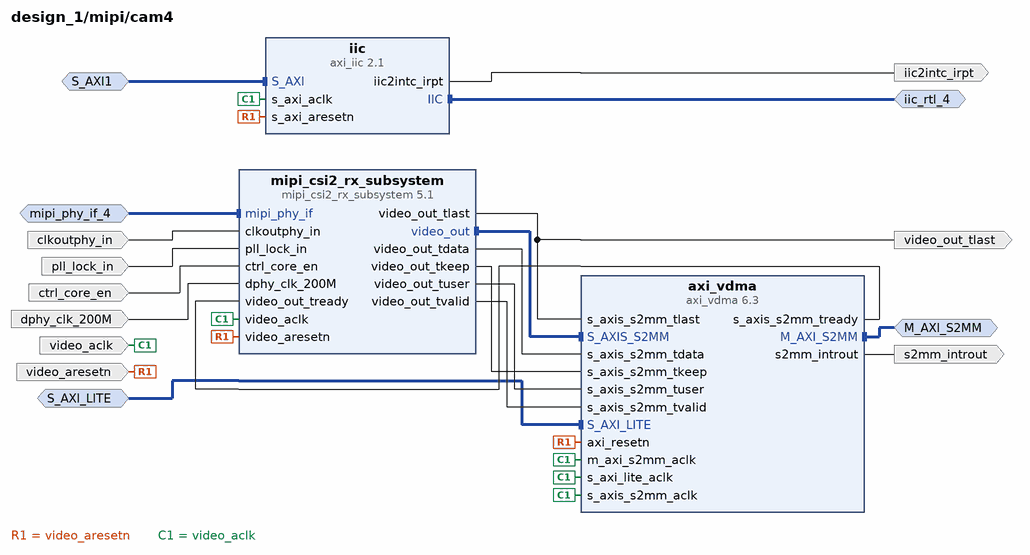
[diagram p7: block diagram inside /mipi/cam4]
create_bd_intf_pin -mode Slave -vlnv xilinx.com:interface:aximm_rtl:1.0 S_AXI1
create_bd_intf_pin -mode Master -vlnv xilinx.com:interface:iic_rtl:1.0 iic_rtl_4
create_bd_intf_pin -mode Slave -vlnv xilinx.com:interface:mipi_phy_rtl:1.0 mipi_phy_if_4
create_bd_intf_pin -mode Slave -vlnv xilinx.com:interface:aximm_rtl:1.0 S_AXI_LITE
create_bd_intf_pin -mode Master -vlnv xilinx.com:interface:aximm_rtl:1.0 M_AXI_S2MM
create_bd_pin -dir I -type clk video_aclk
create_bd_pin -dir I -type rst video_aresetn
create_bd_pin -dir O -type intr iic2intc_irpt
create_bd_pin -dir I -type clk dphy_clk_200M
create_bd_pin -dir I -type clk clkoutphy_in
create_bd_pin -dir I pll_lock_in
create_bd_pin -dir I ctrl_core_en
create_bd_pin -dir O -type intr s2mm_introut
create_bd_pin -dir O video_out_tlast

create_bd_cell -type ip -vlnv xilinx.com:ip:axi_vdma:6.3 axi_vdma
set_property -dict [list \
  CONFIG.c_include_mm2s 0 \
  CONFIG.c_include_s2mm 1 \
  CONFIG.c_num_fstores 4 \
  CONFIG.c_s2mm_genlock_mode 2 \
  CONFIG.c_s2mm_linebuffer_depth 256 \
  CONFIG.c_use_s2mm_fsync 2 \
] [get_bd_cells axi_vdma]
create_bd_cell -type ip -vlnv xilinx.com:ip:axi_iic:2.1 iic
create_bd_cell -type ip -vlnv xilinx.com:ip:mipi_csi2_rx_subsystem:5.1 mipi_csi2_rx_subsystem
set_property -dict [list \
  CONFIG.AXIS_TDATA_WIDTH 32 \
  CONFIG.AXIS_TUSER_WIDTH 1 \
  CONFIG.CLK_LANE_IO_LOC P7 \
  CONFIG.CMN_INC_VFB false \
  CONFIG.CMN_NUM_LANES 2 \
  CONFIG.CMN_PXL_FORMAT RAW20 \
  CONFIG.CSI_BUF_DEPTH 512 \
  CONFIG.CSI_CONTROLLER_REG_IF false \
  CONFIG.C_CLK_LANE_IO_POSITION 32 \
  CONFIG.C_CSI_EN_CRC false \
  CONFIG.C_DATA_LANE0_IO_POSITION 34 \
  CONFIG.C_DATA_LANE1_IO_POSITION 36 \
  CONFIG.C_DPHY_LANES 2 \
  CONFIG.C_EN_BG0_PIN6 false \
  CONFIG.C_EN_BG1_PIN6 false \
  CONFIG.C_EN_CSI_V2_0 true \
  CONFIG.C_HS_LINE_RATE 1100 \
  CONFIG.C_HS_SETTLE_NS 144 \
  CONFIG.DATA_LANE0_IO_LOC N9 \
  CONFIG.DATA_LANE1_IO_LOC M8 \
  CONFIG.DPY_LINE_RATE 1100 \
  CONFIG.HP_IO_BANK_SELECTION 65 \
] [get_bd_cells mipi_csi2_rx_subsystem]

# ---- hierarchy /mipi/cam0 ----
current_bd_instance /mipi/cam0
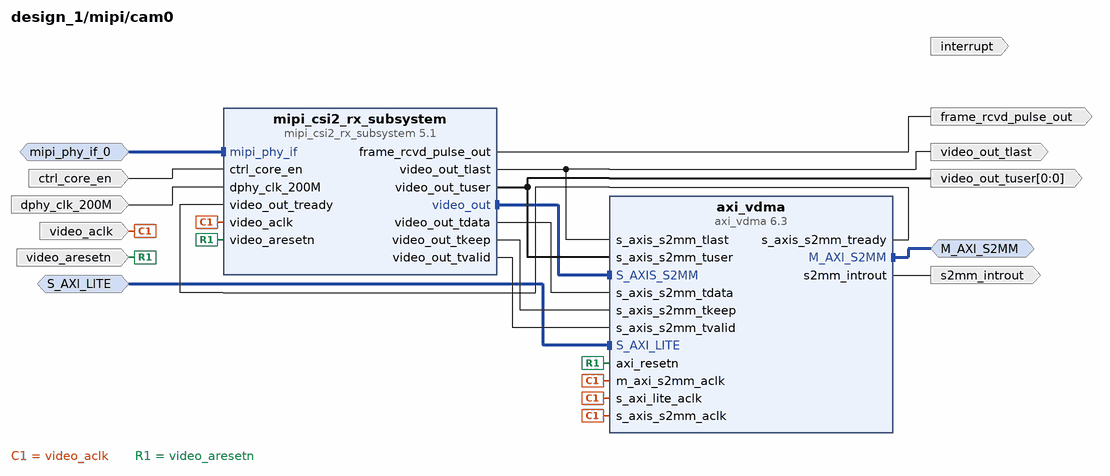
[diagram p8: block diagram inside /mipi/cam0]
create_bd_intf_pin -mode Slave -vlnv xilinx.com:interface:mipi_phy_rtl:1.0 mipi_phy_if_0
create_bd_intf_pin -mode Master -vlnv xilinx.com:interface:aximm_rtl:1.0 M_AXI_S2MM
create_bd_intf_pin -mode Slave -vlnv xilinx.com:interface:aximm_rtl:1.0 S_AXI_LITE
create_bd_pin -dir O -from 0 -to 0 video_out_tuser
create_bd_pin -dir I -type clk dphy_clk_200M
create_bd_pin -dir I -type clk video_aclk
create_bd_pin -dir O frame_rcvd_pulse_out
create_bd_pin -dir I ctrl_core_en
create_bd_pin -dir I -type rst video_aresetn
create_bd_pin -dir O -type intr s2mm_introut
create_bd_pin -dir O -type intr interrupt
create_bd_pin -dir O video_out_tlast

create_bd_cell -type ip -vlnv xilinx.com:ip:axi_vdma:6.3 axi_vdma
set_property -dict [list \
  CONFIG.c_include_mm2s 0 \
  CONFIG.c_num_fstores 4 \
  CONFIG.c_s2mm_genlock_mode 0 \
  CONFIG.c_s2mm_linebuffer_depth 256 \
  CONFIG.c_use_s2mm_fsync 0 \
] [get_bd_cells axi_vdma]
create_bd_cell -type ip -vlnv xilinx.com:ip:mipi_csi2_rx_subsystem:5.1 mipi_csi2_rx_subsystem
set_property -dict [list \
  CONFIG.AXIS_TDATA_WIDTH 32 \
  CONFIG.AXIS_TUSER_WIDTH 1 \
  CONFIG.CLK_LANE_IO_LOC D7 \
  CONFIG.CMN_INC_VFB false \
  CONFIG.CMN_NUM_LANES 4 \
  CONFIG.CMN_PXL_FORMAT RAW20 \
  CONFIG.CSI_BUF_DEPTH 512 \
  CONFIG.CSI_CONTROLLER_REG_IF false \
  CONFIG.C_CLK_LANE_IO_POSITION 26 \
  CONFIG.C_CSI_EN_CRC false \
  CONFIG.C_DATA_LANE0_IO_POSITION 28 \
  CONFIG.C_DATA_LANE1_IO_POSITION 30 \
  CONFIG.C_DATA_LANE2_IO_POSITION 32 \
  CONFIG.C_DATA_LANE3_IO_POSITION 34 \
  CONFIG.C_DPHY_LANES 4 \
  CONFIG.C_EN_BG0_PIN0 false \
  CONFIG.C_EN_BG1_PIN0 false \
  CONFIG.C_EN_CSI_V2_0 true \
  CONFIG.C_HS_LINE_RATE 1100 \
  CONFIG.C_HS_SETTLE_NS 144 \
  CONFIG.DATA_LANE0_IO_LOC E5 \
  CONFIG.DATA_LANE1_IO_LOC G6 \
  CONFIG.DATA_LANE2_IO_LOC G8 \
  CONFIG.DATA_LANE3_IO_LOC F8 \
  CONFIG.DPY_LINE_RATE 1100 \
  CONFIG.HP_IO_BANK_SELECTION 66 \
  CONFIG.SupportLevel 1 \
] [get_bd_cells mipi_csi2_rx_subsystem]

# ---- hierarchy /interrupts ----
current_bd_instance /interrupts
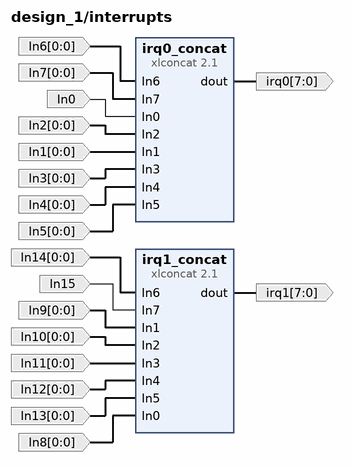
[diagram p9: block diagram inside /interrupts]
create_bd_pin -dir I -from 0 -to 0 In8
create_bd_pin -dir I -from 0 -to 0 In9
create_bd_pin -dir I -from 0 -to 0 In1
create_bd_pin -dir I -from 0 -to 0 In2
create_bd_pin -dir I -from 0 -to 0 In3
create_bd_pin -dir I -from 0 -to 0 In4
create_bd_pin -dir I -from 0 -to 0 In5
create_bd_pin -dir I -from 0 -to 0 In6
create_bd_pin -dir I -from 0 -to 0 In7
create_bd_pin -dir I -from 0 -to 0 In14
create_bd_pin -dir I -from 0 -to 0 In10
create_bd_pin -dir I -from 0 -to 0 In11
create_bd_pin -dir I -from 0 -to 0 In12
create_bd_pin -dir I -from 0 -to 0 In13
create_bd_pin -dir O -from 7 -to 0 irq1
create_bd_pin -dir O -from 7 -to 0 irq0
create_bd_pin -dir I -type intr In0
create_bd_pin -dir I -type intr In15

create_bd_cell -type ip -vlnv xilinx.com:ip:xlconcat:2.1 irq0_concat
set_property -dict {CONFIG.NUM_PORTS 8 CONFIG.dout_width 8} [get_bd_cells irq0_concat]
create_bd_cell -type ip -vlnv xilinx.com:ip:xlconcat:2.1 irq1_concat
set_property -dict {CONFIG.NUM_PORTS 8 CONFIG.dout_width 8} [get_bd_cells irq1_concat]

# ---- hierarchy /user_i2c ----
current_bd_instance /user_i2c
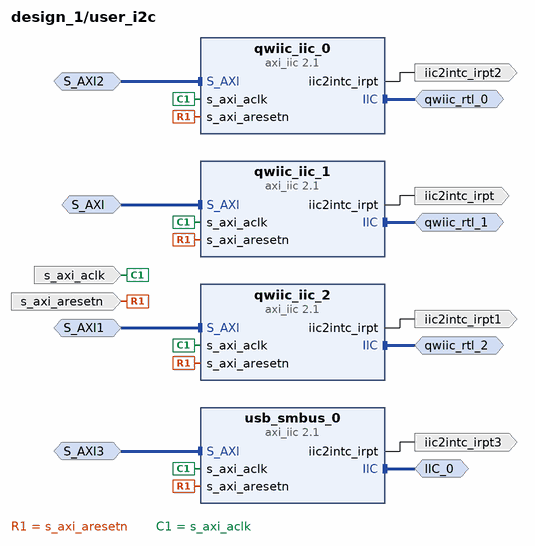
[diagram p10: block diagram inside /user_i2c]
create_bd_intf_pin -mode Slave -vlnv xilinx.com:interface:aximm_rtl:1.0 S_AXI
create_bd_intf_pin -mode Master -vlnv xilinx.com:interface:iic_rtl:1.0 qwiic_rtl_1
create_bd_intf_pin -mode Slave -vlnv xilinx.com:interface:aximm_rtl:1.0 S_AXI1
create_bd_intf_pin -mode Master -vlnv xilinx.com:interface:iic_rtl:1.0 qwiic_rtl_2
create_bd_intf_pin -mode Slave -vlnv xilinx.com:interface:aximm_rtl:1.0 S_AXI2
create_bd_intf_pin -mode Master -vlnv xilinx.com:interface:iic_rtl:1.0 qwiic_rtl_0
create_bd_intf_pin -mode Master -vlnv xilinx.com:interface:iic_rtl:1.0 IIC_0
create_bd_intf_pin -mode Slave -vlnv xilinx.com:interface:aximm_rtl:1.0 S_AXI3
create_bd_pin -dir I -type clk s_axi_aclk
create_bd_pin -dir I -type rst s_axi_aresetn
create_bd_pin -dir O -type intr iic2intc_irpt
create_bd_pin -dir O -type intr iic2intc_irpt1
create_bd_pin -dir O -type intr iic2intc_irpt2
create_bd_pin -dir O -type intr iic2intc_irpt3

create_bd_cell -type ip -vlnv xilinx.com:ip:axi_iic:2.1 qwiic_iic_0
create_bd_cell -type ip -vlnv xilinx.com:ip:axi_iic:2.1 qwiic_iic_1
create_bd_cell -type ip -vlnv xilinx.com:ip:axi_iic:2.1 qwiic_iic_2
create_bd_cell -type ip -vlnv xilinx.com:ip:axi_iic:2.1 usb_smbus_0

# ---- hierarchy /Debug ----
current_bd_instance /Debug
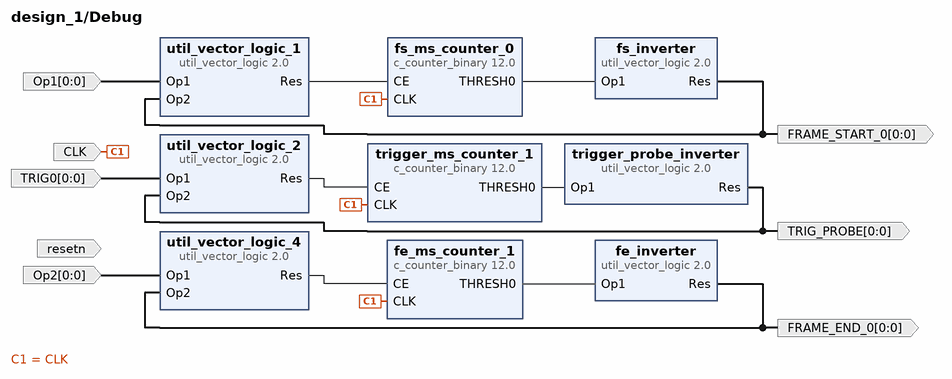
[diagram p11: block diagram inside /Debug]
create_bd_pin -dir O -from 0 -to 0 FRAME_START_0
create_bd_pin -dir O -from 0 -to 0 TRIG_PROBE
create_bd_pin -dir I -from 0 -to 0 Op1
create_bd_pin -dir O -from 0 -to 0 FRAME_END_0
create_bd_pin -dir I -from 0 -to 0 TRIG0
create_bd_pin -dir I -from 0 -to 0 Op2
create_bd_pin -dir I -type clk CLK
create_bd_pin -dir I -type rst resetn

create_bd_cell -type ip -vlnv xilinx.com:ip:util_vector_logic:2.0 fe_inverter
set_property -dict {CONFIG.C_OPERATION not CONFIG.C_SIZE 1} [get_bd_cells fe_inverter]
create_bd_cell -type ip -vlnv xilinx.com:ip:c_counter_binary:12.0 fe_ms_counter_1
set_property -dict [list \
  CONFIG.CE true \
  CONFIG.Final_Count_Value 186A0 \
  CONFIG.Implementation Fabric \
  CONFIG.Load false \
  CONFIG.Output_Width 17 \
  CONFIG.Restrict_Count true \
  CONFIG.SCLR false \
  CONFIG.Sync_Threshold_Output true \
  CONFIG.Threshold_Value 18699 \
] [get_bd_cells fe_ms_counter_1]
create_bd_cell -type ip -vlnv xilinx.com:ip:util_vector_logic:2.0 fs_inverter
set_property -dict {CONFIG.C_OPERATION not CONFIG.C_SIZE 1} [get_bd_cells fs_inverter]
create_bd_cell -type ip -vlnv xilinx.com:ip:c_counter_binary:12.0 fs_ms_counter_0
set_property -dict [list \
  CONFIG.CE true \
  CONFIG.Final_Count_Value 186A0 \
  CONFIG.Implementation Fabric \
  CONFIG.Load false \
  CONFIG.Output_Width 17 \
  CONFIG.Restrict_Count true \
  CONFIG.SCLR false \
  CONFIG.Sync_Threshold_Output true \
  CONFIG.Threshold_Value 18699 \
] [get_bd_cells fs_ms_counter_0]
create_bd_cell -type ip -vlnv xilinx.com:ip:c_counter_binary:12.0 trigger_ms_counter_1
set_property -dict [list \
  CONFIG.CE true \
  CONFIG.Final_Count_Value 186A0 \
  CONFIG.Implementation Fabric \
  CONFIG.Load false \
  CONFIG.Output_Width 17 \
  CONFIG.Restrict_Count true \
  CONFIG.SCLR false \
  CONFIG.Sync_Threshold_Output true \
  CONFIG.Threshold_Value 18699 \
] [get_bd_cells trigger_ms_counter_1]
create_bd_cell -type ip -vlnv xilinx.com:ip:util_vector_logic:2.0 trigger_probe_inverter
set_property -dict {CONFIG.C_OPERATION not CONFIG.C_SIZE 1} [get_bd_cells trigger_probe_inverter]
create_bd_cell -type ip -vlnv xilinx.com:ip:util_vector_logic:2.0 util_vector_logic_1
set_property -dict {CONFIG.C_OPERATION or CONFIG.C_SIZE 1} [get_bd_cells util_vector_logic_1]
create_bd_cell -type ip -vlnv xilinx.com:ip:util_vector_logic:2.0 util_vector_logic_2
set_property -dict {CONFIG.C_OPERATION or CONFIG.C_SIZE 1} [get_bd_cells util_vector_logic_2]
create_bd_cell -type ip -vlnv xilinx.com:ip:util_vector_logic:2.0 util_vector_logic_4
set_property -dict {CONFIG.C_OPERATION or CONFIG.C_SIZE 1} [get_bd_cells util_vector_logic_4]

# ---- connections ----

current_bd_instance /GPIO
connect_bd_net [get_bd_pins GPIO] [get_bd_pins util_ds_buf_0/IOBUF_IO_IO]
connect_bd_net [get_bd_pins USER_DIP] [get_bd_pins gpi_concat/In1]
connect_bd_net [get_bd_pins cam_enable_slice/Dout] [get_bd_pins ENABLE]
connect_bd_net [get_bd_pins gpi_concat/dout] [get_bd_pins dout]
connect_bd_net [get_bd_pins gpio_i_slice/Dout] [get_bd_pins util_ds_buf_0/IOBUF_IO_I]
connect_bd_net [get_bd_pins gpio_t_slice/Dout] [get_bd_pins util_ds_buf_0/IOBUF_IO_T]
connect_bd_net [get_bd_pins gpio_trigger_slice/Dout] [get_bd_pins TRIG0]
connect_bd_net [get_bd_pins user_led_slice/Dout] [get_bd_pins USER_LEDS]
connect_bd_net [get_bd_pins util_ds_buf_0/IOBUF_IO_O] [get_bd_pins gpi_concat/In2]
connect_bd_net -net zynq_ultra_ps_e_0_emio_gpio_o [get_bd_pins Din] \
  [get_bd_pins cam_enable_slice/Din] [get_bd_pins user_led_slice/Din] [get_bd_pins gpio_i_slice/Din] \
  [get_bd_pins gpio_trigger_slice/Din]
connect_bd_net -net zynq_ultra_ps_e_0_emio_gpio_t [get_bd_pins Din1] [get_bd_pins gpio_t_slice/Din]

current_bd_instance /mipi
connect_bd_intf_net [get_bd_intf_pins M00_AXI] [get_bd_intf_pins axi_smc/M00_AXI]
connect_bd_intf_net [get_bd_intf_pins M00_AXI1] [get_bd_intf_pins axi_smc_1/M00_AXI]
connect_bd_intf_net [get_bd_intf_pins iic_rtl_3] [get_bd_intf_pins cam3/iic_rtl_3]
connect_bd_intf_net [get_bd_intf_pins S_AXI] [get_bd_intf_pins line_counter/S_AXI]
connect_bd_intf_net [get_bd_intf_pins S_AXI2] [get_bd_intf_pins trigger_timer/S_AXI]
connect_bd_intf_net [get_bd_intf_pins iic_rtl_1] [get_bd_intf_pins cam1/iic_rtl_1]
connect_bd_intf_net [get_bd_intf_pins iic_rtl_4] [get_bd_intf_pins cam4/iic_rtl_4]
connect_bd_intf_net [get_bd_intf_pins iic_rtl_5] [get_bd_intf_pins cam5/iic_rtl_5]
connect_bd_intf_net [get_bd_intf_pins cam0/M_AXI_S2MM] [get_bd_intf_pins axi_smc/S00_AXI]
connect_bd_intf_net [get_bd_intf_pins cam1/M_AXI_S2MM] [get_bd_intf_pins axi_smc/S01_AXI]
connect_bd_intf_net [get_bd_intf_pins cam2/M_AXI_S2MM] [get_bd_intf_pins axi_smc_1/S00_AXI]
connect_bd_intf_net [get_bd_intf_pins iic_rtl_2] [get_bd_intf_pins cam2/iic_rtl_2]
connect_bd_intf_net [get_bd_intf_pins cam3/M_AXI_S2MM] [get_bd_intf_pins axi_smc_1/S01_AXI]
connect_bd_intf_net [get_bd_intf_pins cam4/M_AXI_S2MM] [get_bd_intf_pins axi_smc_1/S02_AXI]
connect_bd_intf_net [get_bd_intf_pins cam5/M_AXI_S2MM] [get_bd_intf_pins axi_smc_1/S03_AXI]
connect_bd_intf_net [get_bd_intf_pins mipi_phy_if_0] [get_bd_intf_pins cam0/mipi_phy_if_0]
connect_bd_intf_net [get_bd_intf_pins mipi_phy_if_1] [get_bd_intf_pins cam1/mipi_phy_if_1]
connect_bd_intf_net [get_bd_intf_pins mipi_phy_if_2] [get_bd_intf_pins cam2/mipi_phy_if_2]
connect_bd_intf_net [get_bd_intf_pins mipi_phy_if_3] [get_bd_intf_pins cam3/mipi_phy_if_3]
connect_bd_intf_net [get_bd_intf_pins mipi_phy_if_4] [get_bd_intf_pins cam4/mipi_phy_if_4]
connect_bd_intf_net [get_bd_intf_pins mipi_phy_if_5] [get_bd_intf_pins cam5/mipi_phy_if_5]
connect_bd_intf_net [get_bd_intf_pins S_AXI_LITE5] [get_bd_intf_pins cam0/S_AXI_LITE]
connect_bd_intf_net [get_bd_intf_pins S_AXI_LITE] [get_bd_intf_pins cam1/S_AXI_LITE]
connect_bd_intf_net [get_bd_intf_pins S_AXI1] [get_bd_intf_pins cam1/S_AXI1]
connect_bd_intf_net [get_bd_intf_pins S_AXI8] [get_bd_intf_pins cam2/S_AXI]
connect_bd_intf_net [get_bd_intf_pins S_AXI10] [get_bd_intf_pins cam3/S_AXI1]
connect_bd_intf_net [get_bd_intf_pins S_AXI12] [get_bd_intf_pins cam4/S_AXI1]
connect_bd_intf_net [get_bd_intf_pins S_AXI6] [get_bd_intf_pins cam5/S_AXI1]
connect_bd_intf_net [get_bd_intf_pins S_AXI_LITE2] [get_bd_intf_pins cam2/S_AXI_LITE]
connect_bd_intf_net [get_bd_intf_pins S_AXI_LITE3] [get_bd_intf_pins cam3/S_AXI_LITE]
connect_bd_intf_net [get_bd_intf_pins S_AXI_LITE4] [get_bd_intf_pins cam4/S_AXI_LITE]
connect_bd_intf_net [get_bd_intf_pins S_AXI_LITE1] [get_bd_intf_pins cam5/S_AXI_LITE]
connect_bd_net [get_bd_pins Din] [get_bd_pins line_counter_select/Din]
connect_bd_net -net axi_vdma_1_s2mm_introut [get_bd_pins cam1/s2mm_introut] [get_bd_pins s2mm_introut]
connect_bd_net -net axi_vdma_2_s2mm_introut1 [get_bd_pins cam2/s2mm_introut] [get_bd_pins s2mm_introut2]
connect_bd_net -net axi_vdma_3_s2mm_introut [get_bd_pins cam3/s2mm_introut] [get_bd_pins s2mm_introut3]
connect_bd_net -net axi_vdma_4_s2mm_introut [get_bd_pins cam4/s2mm_introut] [get_bd_pins s2mm_introut4]
connect_bd_net -net axi_vdma_5_s2mm_introut [get_bd_pins cam5/s2mm_introut] [get_bd_pins s2mm_introut1]
connect_bd_net [get_bd_pins cam0/video_out_tlast] [get_bd_pins end_line_concat/In0]
connect_bd_net [get_bd_pins cam1/video_out_tlast] [get_bd_pins end_line_concat/In1]
connect_bd_net -net cam2_mipi_block_two_lane_iic2intc_irpt [get_bd_pins cam2/iic2intc_irpt] [get_bd_pins iic2intc_irpt5]
connect_bd_net [get_bd_pins cam2/video_out_tlast] [get_bd_pins end_line_concat/In2]
connect_bd_net [get_bd_pins cam3/video_out_tlast] [get_bd_pins end_line_concat/In3]
connect_bd_net [get_bd_pins cam4/video_out_tlast] [get_bd_pins end_line_concat/In4]
connect_bd_net [get_bd_pins cam5/video_out_tlast] [get_bd_pins end_line_concat/In5]
connect_bd_net -net cam_iic_1_iic2intc_irpt [get_bd_pins cam1/iic2intc_irpt] [get_bd_pins iic2intc_irpt]
connect_bd_net -net cam_iic_3_iic2intc_irpt [get_bd_pins cam3/iic2intc_irpt] [get_bd_pins iic2intc_irpt6]
connect_bd_net -net cam_iic_4_iic2intc_irpt [get_bd_pins cam4/iic2intc_irpt] [get_bd_pins iic2intc_irpt7]
connect_bd_net -net cam_iic_5_iic2intc_irpt [get_bd_pins cam5/iic2intc_irpt] [get_bd_pins iic2intc_irpt4]
connect_bd_net [get_bd_pins end_line_concat/dout] [get_bd_pins selector/Op1]
connect_bd_net -net end_of_line_select_Dout [get_bd_pins line_counter_select/Dout] [get_bd_pins selector/Op2]
connect_bd_net [get_bd_pins line_counter/interrupt] [get_bd_pins interrupt6]
connect_bd_net [get_bd_pins line_end_inverter/Res] [get_bd_pins line_counter/freeze]
connect_bd_net -net mipi_block_four_lane_frame_rcvd_pulse_out [get_bd_pins cam0/frame_rcvd_pulse_out] [get_bd_pins frame_rcvd_pulse_out]
connect_bd_net -net mipi_block_four_lane_interrupt [get_bd_pins cam0/interrupt] [get_bd_pins interrupt5]
connect_bd_net -net mipi_block_four_lane_s2mm_introut [get_bd_pins cam0/s2mm_introut] [get_bd_pins s2mm_introut5]
connect_bd_net -net mipi_csi2_rx_subsyst_0_clkoutphy_out [get_bd_pins cam1/clkoutphy_out] \
  [get_bd_pins cam2/clkoutphy_in] [get_bd_pins cam4/clkoutphy_in] [get_bd_pins cam5/clkoutphy_in] \
  [get_bd_pins axi_smc_1/aclk1]
connect_bd_net -net mipi_csi2_rx_subsyst_0_pll_lock_out [get_bd_pins cam1/pll_lock_out] \
  [get_bd_pins cam2/pll_lock_in] [get_bd_pins cam4/pll_lock_in] [get_bd_pins cam5/pll_lock_in]
connect_bd_net -net mipi_csi2_rx_subsyst_0_video_out_tuser [get_bd_pins cam0/video_out_tuser] [get_bd_pins video_out_tuser]
connect_bd_net [get_bd_pins reduce_line_counters/Res] [get_bd_pins line_end_inverter/Op1]
connect_bd_net -net rst_ps8_0_49M_peripheral_aresetn [get_bd_pins video_aresetn] \
  [get_bd_pins cam0/video_aresetn] [get_bd_pins cam2/video_aresetn] [get_bd_pins cam3/s_axi_aresetn] \
  [get_bd_pins cam4/video_aresetn] [get_bd_pins cam5/video_aresetn] [get_bd_pins cam1/axi_resetn] \
  [get_bd_pins axi_smc/aresetn] [get_bd_pins axi_smc_1/aresetn] [get_bd_pins line_counter/s_axi_aresetn] \
  [get_bd_pins trigger_timer/s_axi_aresetn]
connect_bd_net [get_bd_pins trigger_timer/pwm0] [get_bd_pins TRIG1]
connect_bd_net -net util_vector_logic_0_Res1 [get_bd_pins selector/Res] [get_bd_pins reduce_line_counters/Op1]
connect_bd_net [get_bd_pins xlconstant_0/dout] \
  [get_bd_pins cam0/ctrl_core_en] [get_bd_pins cam2/ctrl_core_en] [get_bd_pins cam3/ctrl_core_en] \
  [get_bd_pins cam4/ctrl_core_en] [get_bd_pins cam5/ctrl_core_en] [get_bd_pins cam1/ctrl_core_en]
connect_bd_net [get_bd_pins xlconstant_1/dout] \
  [get_bd_pins axi_smc/S00_AXI_awcache] [get_bd_pins axi_smc/S01_AXI_awcache] [get_bd_pins axi_smc_1/S00_AXI_awcache] \
  [get_bd_pins axi_smc_1/S01_AXI_awcache] [get_bd_pins axi_smc_1/S02_AXI_awcache] [get_bd_pins axi_smc_1/S03_AXI_awcache]
connect_bd_net [get_bd_pins xlconstant_2/dout] \
  [get_bd_pins axi_smc/S00_AXI_awprot] [get_bd_pins axi_smc/S01_AXI_awprot] [get_bd_pins axi_smc_1/S00_AXI_awprot] \
  [get_bd_pins axi_smc_1/S01_AXI_awprot] [get_bd_pins axi_smc_1/S02_AXI_awprot] [get_bd_pins axi_smc_1/S03_AXI_awprot]
connect_bd_net -net zynq_ultra_ps_e_0_pl_clk0 [get_bd_pins dphy_clk_200M] \
  [get_bd_pins cam0/dphy_clk_200M] [get_bd_pins cam2/dphy_clk_200M] [get_bd_pins cam3/dphy_clk_200M] \
  [get_bd_pins cam4/dphy_clk_200M] [get_bd_pins cam5/dphy_clk_200M] [get_bd_pins cam1/dphy_clk_200M]
connect_bd_net -net zynq_ultra_ps_e_0_pl_clk1 [get_bd_pins video_aclk] \
  [get_bd_pins cam0/video_aclk] [get_bd_pins cam2/video_aclk] [get_bd_pins cam3/s_axi_aclk] [get_bd_pins cam4/video_aclk] \
  [get_bd_pins cam5/video_aclk] [get_bd_pins cam1/s_axi_lite_aclk] [get_bd_pins axi_smc/aclk] [get_bd_pins axi_smc_1/aclk] \
  [get_bd_pins line_counter/s_axi_aclk] [get_bd_pins trigger_timer/s_axi_aclk]
